# EAGLE board das48 (EAGLE 9.6.2), part 1 of 3
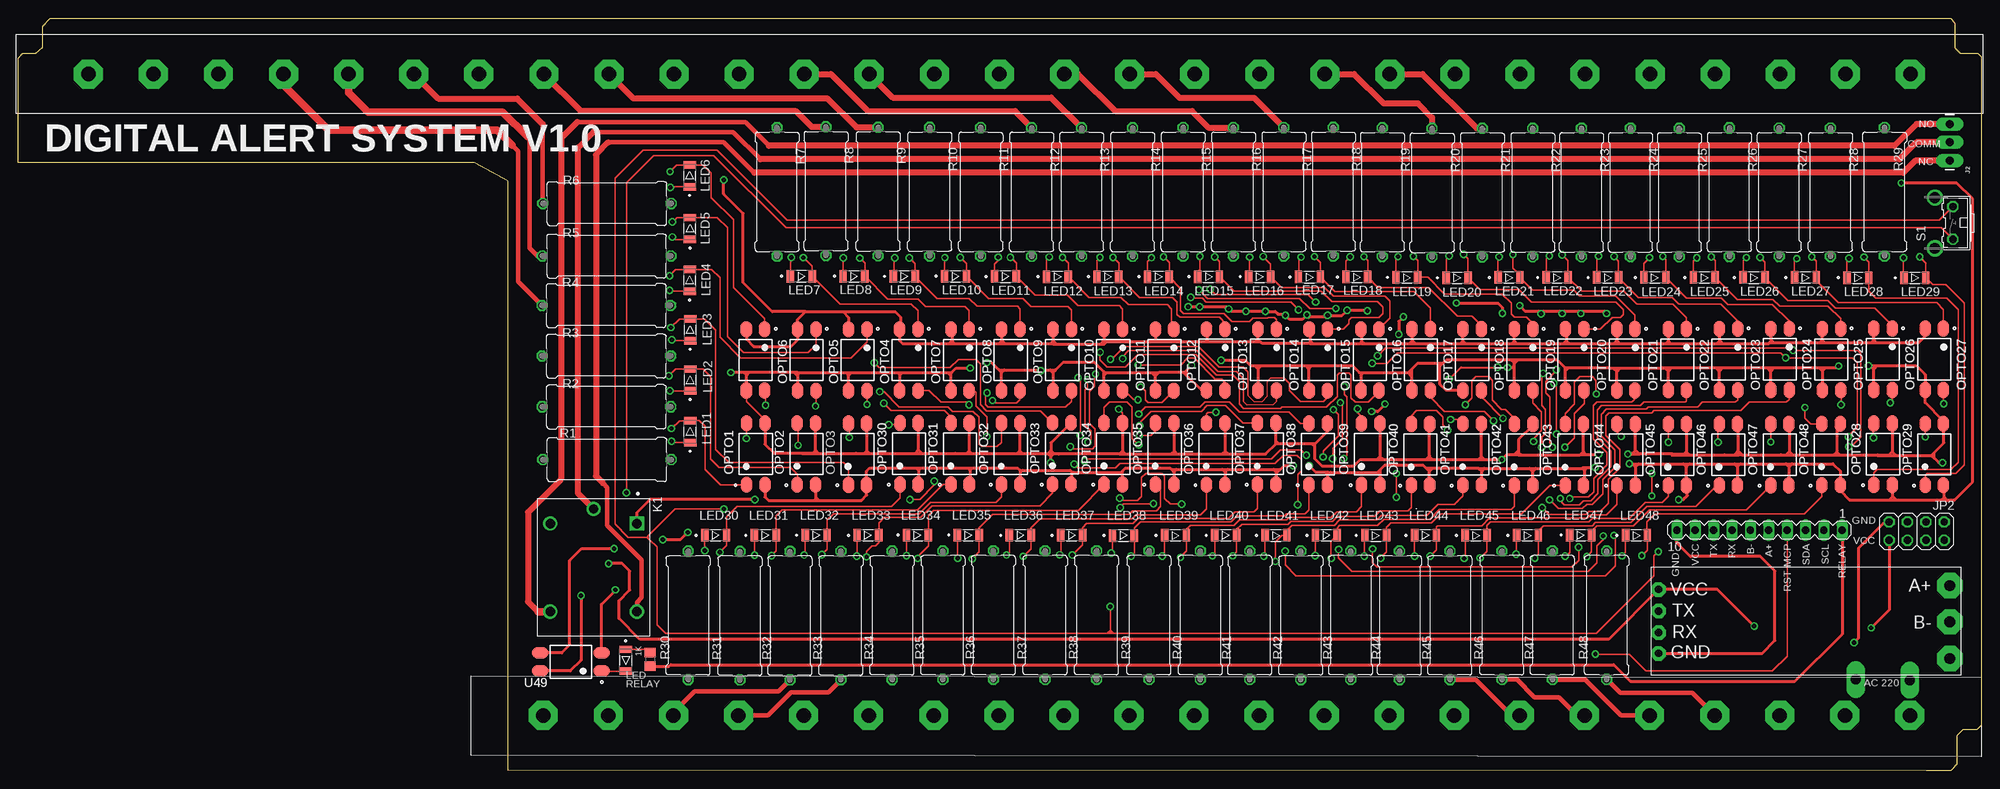
[diagram p1: board, top side]
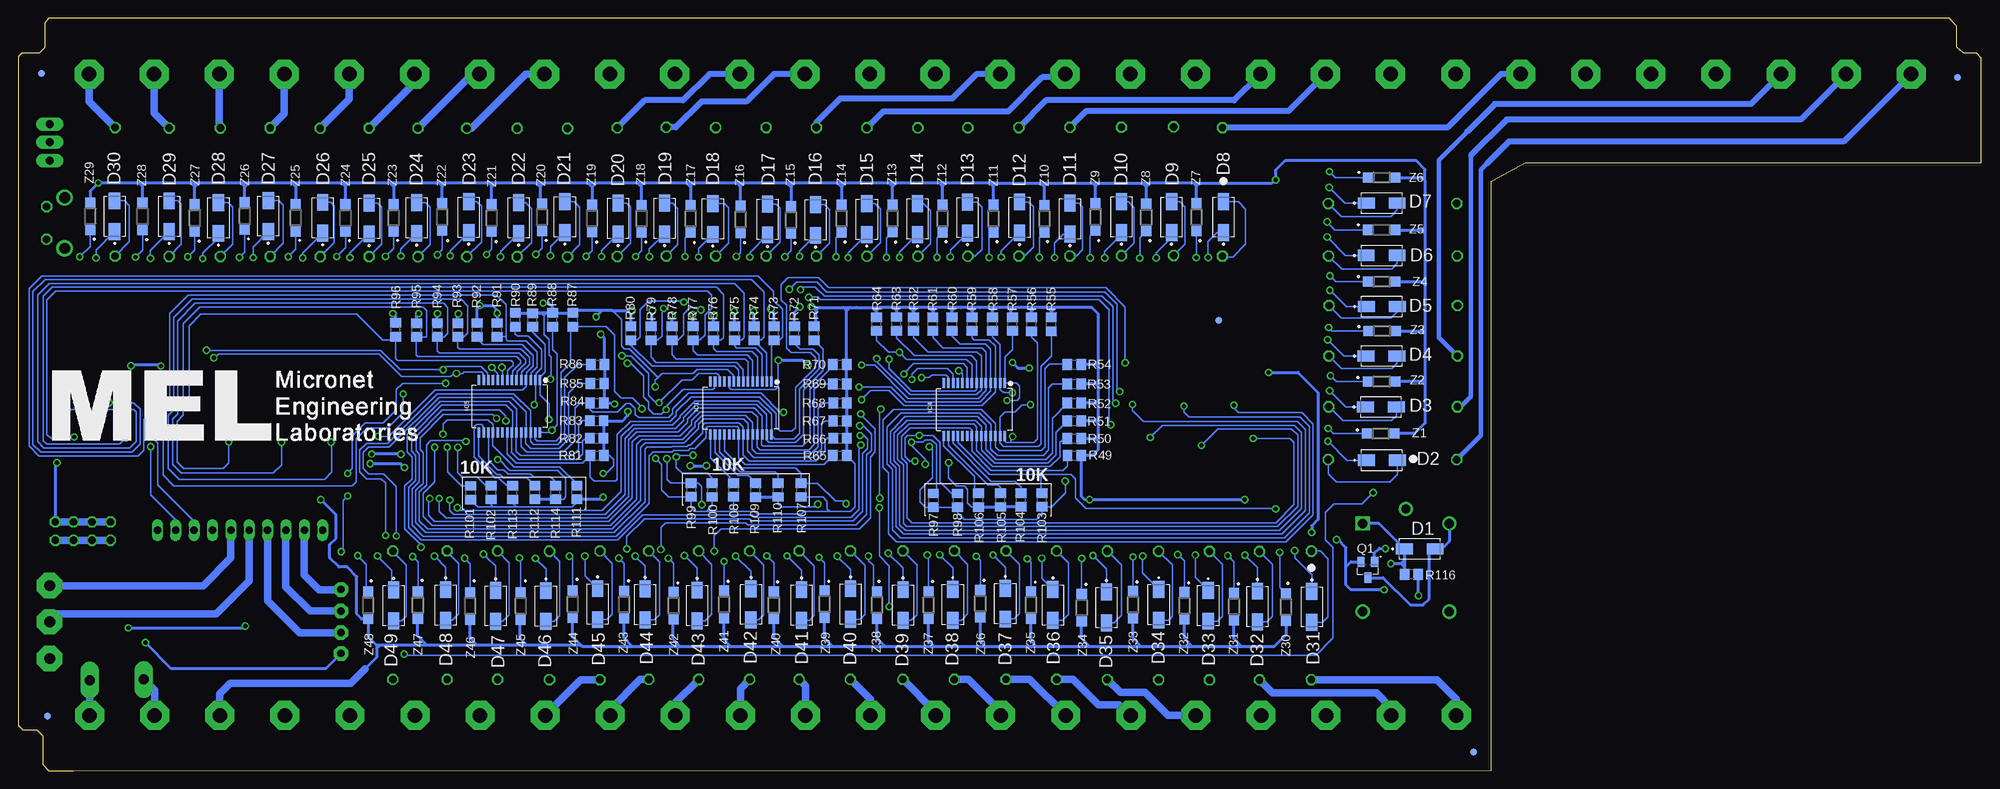
[diagram p2: board, bottom side, seen from below]

Size 271.53 x 104.12 mm. Coordinates in mm from the lower left corner, seen from the top.
Outline: 0.01,84.1 0,97.18 0.01,98.6 0.67,99.26 2.42,99.26 3.4,100.11 3.41,102.98 4.42,104.12 6.94,104.12 264.15,104.12 267.26,104.12 267.87,103.39 267.87,100.03 268.62,99.28 271.02,99.28 271.53,98.77 271.53,96.75 271.53,6.29 270.9,5.67 268.97,5.67 268.14,4.82 268.14,0.86 267.28,0 263.89,0 263.89,0 67.77,0.07 67.8,81.59 63.11,84.1 0.01,84.1
Copper layers (1*16): Top 0.035mm / dielectric 1.5mm / Bottom 0.035mm
Design rules "default *": minimum track width 6mil, minimum drill 0.35mm, track to track 0.2mm, track to pad 0.2mm, pad to pad 0.2mm, via to via 0.2mm, smd to smd 6mil, copper to edge 40mil, drill to drill 0.3mm, minimum pad ring 10mil, minimum via ring 8mil, stop-mask expansion 4mil, vias tented up to drill 25mil, thermal gap 10mil
Net classes: 0 default: drill 0.6 mm, clearance 0.3 mm

## Footprints (pad centres in the part's own frame; a part is rotated, then mirrored left to right if it is on the bottom)
DIOM5226X240N = smd 2.33 x 1.55: A 2.135,0; C -2.135,0
LEDC3216X120N = smd 1.01 x 1.73: + -1.51,0; - 1.51,0
HEADER-29P = drill 2 pad 4 octagon: 1 -109,16.5; 2 -100,16.5; 3 -91,16.5; 4 -82,16.5; 5 -73,16.5; 6 -64,16.5; 7 -55,16.5; 8 -46,16.5; 9 -37,16.5; 10 -28,16.5; 11 -19,16.5; 12 -10,16.5; 13 -1,16.5; 14 8,16.5; 15 17,16.5; 16 26,16.5; 17 35,16.5; 18 44,16.5; 19 53,16.5; 20 62,16.5; 21 71,16.5; 22 80,16.5
HEADER-29P' = drill 2 pad 4 octagon: 1 -116.62,5.07; 2 -107.62,5.07; 3 -98.62,5.07; 4 -89.62,5.07; 5 -80.62,5.07; 6 -71.62,5.07; 7 -62.62,5.07; 8 -53.62,5.07; 9 -44.62,5.07; 10 -35.62,5.07; 11 -26.62,5.07; 12 -17.62,5.07; 13 -8.62,5.07; 14 0.38,5.07; 15 9.38,5.07; 16 18.38,5.07; 17 27.38,5.07; 18 36.38,5.07; 19 45.38,5.07; 20 54.38,5.07; 21 63.38,5.07; 22 72.38,5.07; 23 81.38,5.07; 24 90.38,5.07; 25 99.38,5.07; 26 108.38,5.07; 27 117.38,5.07; 28 126.38,5.07; 29 135.38,5.07
SSOP28DB = smd 0.348 x 1.397: 1 -4.225,-3.656; 2 -3.575,-3.656; 3 -2.925,-3.656; 4 -2.275,-3.656; 5 -1.625,-3.656; 6 -0.975,-3.656; 7 -0.325,-3.656; 8 0.325,-3.656; 9 0.975,-3.656; 10 1.625,-3.656; 11 2.275,-3.656; 12 2.925,-3.656; 13 3.575,-3.656; 14 4.225,-3.656; 15 4.225,3.656; 16 3.575,3.656; 17 2.925,3.656; 18 2.275,3.656; 19 1.625,3.656; 20 0.975,3.656; 21 0.325,3.656; 22 -0.325,3.656; 23 -0.975,3.656; 24 -1.625,3.656; 25 -2.275,3.656; 26 -2.925,3.656; 27 -3.575,3.656; 28 -4.225,3.656
1X03_LONGPADS = drill 1.118 pad 1.88 long: 1 0,0; 2 2.54,0; 3 5.08,0
1X1-BIGPOGO = drill 1.4 pad 2.54 long: P$1 0,0
2X04 = drill 1.016 octagon: 1 -3.81,-1.27; 2 -3.81,1.27; 3 -1.27,-1.27; 4 -1.27,1.27; 5 1.27,-1.27; 6 1.27,1.27; 7 3.81,-1.27; 8 3.81,1.27
RELAY_SRD-05VDC-SL-C = drill 1.32 square: A1 -6.1,6 | drill 1.32: A2 -6.1,-6; NC 6.1,6; NO 6.1,-6 | drill 1.29: COM -8.1,0
SOT254P975X400-4N = smd 2.25 x 1.6: 1 -4.25,1.27; 2 -4.25,-1.27; 3 4.25,-1.27; 4 4.25,1.27
SOT95P240X120-3N = smd 1 x 1.4: 1 -0.95,-1.1; 2 0.95,-1.1; 3 0,1.1
0617/17 = drill 1.016 octagon: 1 -8.89,0; 2 8.89,0
R0805 = smd 1.3 x 1.5: 1 -0.95,0; 2 0.95,0
B3F-31XX = drill 1.016 octagon: 1 -2.261,-1.245; 2 2.261,-1.245 | drill 1.499 pad 2.159: 3 -3.505,1.245; 4 3.505,1.245
MA10-1 = drill 1.016 long: 1 -11.43,0; 2 -8.89,0; 3 -6.35,0; 4 -3.81,0; 5 -1.27,0; 6 1.27,0; 7 3.81,0; 8 6.35,0; 9 8.89,0; 10 11.43,0
TTL-RS485 = drill 1.5 pad 3.5 octagon: A -19.7,-6; B -19.7,-1; P$7 -19.7,4.1 | drill 1 pad 2 octagon: GND 20.6,3.37; RX 20.581,0.505; TX 20.583,-2.493; VCC 20.6,-5.47
FIDUCIAL_1MM = smd 1 x 1: 1 0,0
SOD123 = smd 1.4 x 1.4: A 1.9,0; C -1.9,0

## Placement (x,y rotation side)
D1  US1M-13  [DIOM5226X240N]  77.68,30.68 0 bottom
D2  US1M-13  [DIOM5226X240N]  82.93,42.95 0 bottom
D3  US1M-13  [DIOM5226X240N]  83.06,50.31 0 bottom
D4  US1M-13  [DIOM5226X240N]  82.97,57.38 0 bottom
D5  US1M-13  [DIOM5226X240N]  82.93,64.19 0 bottom
D6  US1M-13  [DIOM5226X240N]  82.95,71.28 0 bottom
D7  US1M-13  [DIOM5226X240N]  82.95,78.53 0 bottom
D8  US1M-13  [DIOM5226X240N]  104.81,76.59 90 bottom
D9  US1M-13  [DIOM5226X240N]  111.99,76.58 90 bottom
D10  US1M-13  [DIOM5226X240N]  118.94,76.59 90 bottom
D11  US1M-13  [DIOM5226X240N]  126.06,76.37 90 bottom
D12  US1M-13  [DIOM5226X240N]  133.02,76.55 90 bottom
D13  US1M-13  [DIOM5226X240N]  140.22,76.51 90 bottom
D14  US1M-13  [DIOM5226X240N]  147.16,76.32 90 bottom
D15  US1M-13  [DIOM5226X240N]  154.16,76.3 90 bottom
D16  US1M-13  [DIOM5226X240N]  161.23,76.2 90 bottom
D17  US1M-13  [DIOM5226X240N]  167.87,76.27 90 bottom
D18  US1M-13  [DIOM5226X240N]  175.46,76.34 90 bottom
D19  US1M-13  [DIOM5226X240N]  182.1,76.39 90 bottom
D20  US1M-13  [DIOM5226X240N]  188.54,76.39 90 bottom
D21  US1M-13  [DIOM5226X240N]  195.91,76.59 90 bottom
D22  US1M-13  [DIOM5226X240N]  202.3,76.48 90 bottom
D23  US1M-13  [DIOM5226X240N]  209.2,76.58 90 bottom
D24  US1M-13  [DIOM5226X240N]  216.41,76.47 90 bottom
D25  US1M-13  [DIOM5226X240N]  222.99,76.39 90 bottom
D26  US1M-13  [DIOM5226X240N]  229.41,76.5 90 bottom
D27  US1M-13  [DIOM5226X240N]  236.92,76.72 90 bottom
D28  US1M-13  [DIOM5226X240N]  243.82,76.46 90 bottom
D29  US1M-13  [DIOM5226X240N]  250.61,76.7 90 bottom
D30  US1M-13  [DIOM5226X240N]  258.19,76.7 90 bottom
D31  US1M-13  [DIOM5226X240N]  92.61,22.66 270 bottom
D32  US1M-13  [DIOM5226X240N]  100.14,22.7 270 bottom
D33  US1M-13  [DIOM5226X240N]  106.94,22.82 270 bottom
D34  US1M-13  [DIOM5226X240N]  113.78,22.96 270 bottom
D35  US1M-13  [DIOM5226X240N]  121.01,22.58 270 bottom
D36  US1M-13  [DIOM5226X240N]  128.43,22.93 270 bottom
D37  US1M-13  [DIOM5226X240N]  135,23.1 270 bottom
D38  US1M-13  [DIOM5226X240N]  142.26,22.95 270 bottom
D39  US1M-13  [DIOM5226X240N]  149.13,22.92 270 bottom
D40  US1M-13  [DIOM5226X240N]  156.42,23.05 270 bottom
D41  US1M-13  [DIOM5226X240N]  163.19,22.91 270 bottom
D42  US1M-13  [DIOM5226X240N]  170.18,23.01 270 bottom
D43  US1M-13  [DIOM5226X240N]  177.62,22.85 270 bottom
D44  US1M-13  [DIOM5226X240N]  184.82,22.99 270 bottom
D45  US1M-13  [DIOM5226X240N]  191.37,23.04 270 bottom
D46  US1M-13  [DIOM5226X240N]  198.54,22.77 270 bottom
D47  US1M-13  [DIOM5226X240N]  205.5,22.8 270 bottom
D48  US1M-13  [DIOM5226X240N]  212.42,22.92 270 bottom
D49  US1M-13  [DIOM5226X240N]  219.61,22.86 270 bottom
D146  LHN974_RED_LED_1206  [LEDC3216X120N]  84.02,15.28 270 top
HEADER-22P1  [HEADER-29P]  181.64,-8.86 0 top
HEADER-29P1  [HEADER-29P']  126.33,91.31 0 top
IC1  MCP23017SS  [SSOP28DB]  171.56,50.18 180 bottom
IC4  MCP23017SS  [SSOP28DB]  139.3,49.98 180 bottom
IC5  MCP23017SS  [SSOP28DB]  203.56,50.42 180 bottom
J2  [1X03_LONGPADS]  267.16,84.39 90 top
JP1  [1X1-BIGPOGO]  261.62,12.52 90 top
JP2  [2X04]  262.58,33.15 0 top
JP3  [1X1-BIGPOGO]  254.15,12.62 90 top
K1  SRD-05VDC-SL-C  [RELAY_SRD-05VDC-SL-C]  79.59,28.1 270 top
LED1  LHN974_RED_LED_1206  [LEDC3216X120N]  92.94,46.89 90 top
LED2  LHN974_RED_LED_1206  [LEDC3216X120N]  92.95,54.06 90 top
LED3  LHN974_RED_LED_1206  [LEDC3216X120N]  92.95,61 90 top
LED4  LHN974_RED_LED_1206  [LEDC3216X120N]  92.89,67.83 90 top
LED5  LHN974_RED_LED_1206  [LEDC3216X120N]  92.92,75.01 90 top
LED6  LHN974_RED_LED_1206  [LEDC3216X120N]  92.88,82.29 90 top
LED7  LHN974_RED_LED_1206  [LEDC3216X120N]  108.31,68.42 0 top
LED8  LHN974_RED_LED_1206  [LEDC3216X120N]  115.61,68.41 0 top
LED9  LHN974_RED_LED_1206  [LEDC3216X120N]  122.56,68.39 0 top
LED10  LHN974_RED_LED_1206  [LEDC3216X120N]  129.65,68.4 0 top
LED11  LHN974_RED_LED_1206  [LEDC3216X120N]  136.56,68.36 0 top
LED12  LHN974_RED_LED_1206  [LEDC3216X120N]  143.74,68.33 0 top
LED13  LHN974_RED_LED_1206  [LEDC3216X120N]  150.73,68.34 0 top
LED14  LHN974_RED_LED_1206  [LEDC3216X120N]  157.7,68.34 0 top
LED15  LHN974_RED_LED_1206  [LEDC3216X120N]  164.64,68.34 0 top
LED16  LHN974_RED_LED_1206  [LEDC3216X120N]  171.72,68.34 0 top
LED17  LHN974_RED_LED_1206  [LEDC3216X120N]  178.59,68.29 0 top
LED18  LHN974_RED_LED_1206  [LEDC3216X120N]  185.15,68.3 0 top
LED19  LHN974_RED_LED_1206  [LEDC3216X120N]  192.07,68.25 0 top
LED20  LHN974_RED_LED_1206  [LEDC3216X120N]  199.02,68.19 0 top
LED21  LHN974_RED_LED_1206  [LEDC3216X120N]  206.18,68.23 0 top
LED22  LHN974_RED_LED_1206  [LEDC3216X120N]  212.85,68.23 0 top
LED23  LHN974_RED_LED_1206  [LEDC3216X120N]  219.83,68.24 0 top
LED24  LHN974_RED_LED_1206  [LEDC3216X120N]  226.37,68.25 0 top
LED25  LHN974_RED_LED_1206  [LEDC3216X120N]  233.19,68.24 0 top
LED26  LHN974_RED_LED_1206  [LEDC3216X120N]  240.08,68.22 0 top
LED27  LHN974_RED_LED_1206  [LEDC3216X120N]  247.18,68.24 0 top
LED28  LHN974_RED_LED_1206  [LEDC3216X120N]  254.45,68.21 0 top
LED29  LHN974_RED_LED_1206  [LEDC3216X120N]  262.33,68.18 0 top
LED30  LHN974_RED_LED_1206  [LEDC3216X120N]  96.48,32.57 0 top
LED31  LHN974_RED_LED_1206  [LEDC3216X120N]  103.35,32.57 0 top
LED32  LHN974_RED_LED_1206  [LEDC3216X120N]  110.38,32.58 0 top
LED33  LHN974_RED_LED_1206  [LEDC3216X120N]  117.54,32.57 0 top
LED34  LHN974_RED_LED_1206  [LEDC3216X120N]  124.38,32.59 0 top
LED35  LHN974_RED_LED_1206  [LEDC3216X120N]  131.41,32.6 0 top
LED36  LHN974_RED_LED_1206  [LEDC3216X120N]  138.61,32.57 0 top
LED37  LHN974_RED_LED_1206  [LEDC3216X120N]  145.71,32.57 0 top
LED38  LHN974_RED_LED_1206  [LEDC3216X120N]  152.86,32.55 0 top
LED39  LHN974_RED_LED_1206  [LEDC3216X120N]  160.07,32.56 0 top
LED40  LHN974_RED_LED_1206  [LEDC3216X120N]  167.02,32.56 0 top
LED41  LHN974_RED_LED_1206  [LEDC3216X120N]  173.98,32.55 0 top
LED42  LHN974_RED_LED_1206  [LEDC3216X120N]  180.93,32.56 0 top
LED43  LHN974_RED_LED_1206  [LEDC3216X120N]  187.76,32.55 0 top
LED44  LHN974_RED_LED_1206  [LEDC3216X120N]  194.64,32.56 0 top
LED45  LHN974_RED_LED_1206  [LEDC3216X120N]  201.64,32.56 0 top
LED46  LHN974_RED_LED_1206  [LEDC3216X120N]  208.75,32.56 0 top
LED47  LHN974_RED_LED_1206  [LEDC3216X120N]  216.1,32.59 0 top
LED48  LHN974_RED_LED_1206  [LEDC3216X120N]  223.81,32.56 0 top
OPTO1  PC817X2NIP0F  [SOT254P975X400-4N]  102.03,43.8 90 top
OPTO2  PC817X2NIP0F  [SOT254P975X400-4N]  109.03,43.81 90 top
OPTO3  PC817X2NIP0F  [SOT254P975X400-4N]  116.09,43.78 90 top
OPTO4  PC817X2NIP0F  [SOT254P975X400-4N]  116.11,56.81 270 top
OPTO5  PC817X2NIP0F  [SOT254P975X400-4N]  109.06,56.81 270 top
OPTO6  PC817X2NIP0F  [SOT254P975X400-4N]  101.99,56.83 270 top
OPTO7  PC817X2NIP0F  [SOT254P975X400-4N]  123.18,56.82 270 top
OPTO8  PC817X2NIP0F  [SOT254P975X400-4N]  130.27,56.82 270 top
OPTO9  PC817X2NIP0F  [SOT254P975X400-4N]  137.31,56.82 270 top
OPTO10  PC817X2NIP0F  [SOT254P975X400-4N]  144.39,56.82 270 top
OPTO11  PC817X2NIP0F  [SOT254P975X400-4N]  151.47,56.82 270 top
OPTO12  PC817X2NIP0F  [SOT254P975X400-4N]  158.55,56.82 270 top
OPTO13  PC817X2NIP0F  [SOT254P975X400-4N]  165.63,56.83 270 top
OPTO14  PC817X2NIP0F  [SOT254P975X400-4N]  172.74,56.83 270 top
OPTO15  PC817X2NIP0F  [SOT254P975X400-4N]  179.83,56.83 270 top
OPTO16  PC817X2NIP0F  [SOT254P975X400-4N]  186.95,56.83 270 top
OPTO17  PC817X2NIP0F  [SOT254P975X400-4N]  194.03,56.84 270 top
OPTO18  PC817X2NIP0F  [SOT254P975X400-4N]  201.11,56.85 270 top
OPTO19  PC817X2NIP0F  [SOT254P975X400-4N]  208.19,56.85 270 top
OPTO20  PC817X2NIP0F  [SOT254P975X400-4N]  215.28,56.84 270 top
OPTO21  PC817X2NIP0F  [SOT254P975X400-4N]  222.36,56.84 270 top
OPTO22  PC817X2NIP0F  [SOT254P975X400-4N]  229.47,56.86 270 top
OPTO23  PC817X2NIP0F  [SOT254P975X400-4N]  236.55,56.88 270 top
OPTO24  PC817X2NIP0F  [SOT254P975X400-4N]  243.66,56.9 270 top
OPTO25  PC817X2NIP0F  [SOT254P975X400-4N]  250.78,56.9 270 top
OPTO26  PC817X2NIP0F  [SOT254P975X400-4N]  257.9,56.93 270 top
OPTO27  PC817X2NIP0F  [SOT254P975X400-4N]  265.02,56.91 270 top
OPTO28  PC817X2NIP0F  [SOT254P975X400-4N]  257.94,43.78 90 top
OPTO29  PC817X2NIP0F  [SOT254P975X400-4N]  265.02,43.75 90 top
OPTO30  PC817X2NIP0F  [SOT254P975X400-4N]  123.22,43.86 90 top
OPTO31  PC817X2NIP0F  [SOT254P975X400-4N]  130.28,43.85 90 top
OPTO32  PC817X2NIP0F  [SOT254P975X400-4N]  137.29,43.84 90 top
OPTO33  PC817X2NIP0F  [SOT254P975X400-4N]  144.36,43.88 90 top
OPTO34  PC817X2NIP0F  [SOT254P975X400-4N]  151.48,43.86 90 top
OPTO35  PC817X2NIP0F  [SOT254P975X400-4N]  158.58,43.85 90 top
OPTO36  PC817X2NIP0F  [SOT254P975X400-4N]  165.63,43.82 90 top
OPTO37  PC817X2NIP0F  [SOT254P975X400-4N]  172.68,43.84 90 top
OPTO38  PC817X2NIP0F  [SOT254P975X400-4N]  179.78,43.78 90 top
OPTO39  PC817X2NIP0F  [SOT254P975X400-4N]  187.09,43.78 90 top
OPTO40  PC817X2NIP0F  [SOT254P975X400-4N]  193.95,43.73 90 top
OPTO41  PC817X2NIP0F  [SOT254P975X400-4N]  201.09,43.75 90 top
OPTO42  PC817X2NIP0F  [SOT254P975X400-4N]  208.2,43.72 90 top
OPTO43  PC817X2NIP0F  [SOT254P975X400-4N]  215.24,43.71 90 top
OPTO44  PC817X2NIP0F  [SOT254P975X400-4N]  222.4,43.72 90 top
OPTO45  PC817X2NIP0F  [SOT254P975X400-4N]  229.47,43.71 90 top
OPTO46  PC817X2NIP0F  [SOT254P975X400-4N]  236.52,43.72 90 top
OPTO47  PC817X2NIP0F  [SOT254P975X400-4N]  243.65,43.71 90 top
OPTO48  PC817X2NIP0F  [SOT254P975X400-4N]  250.72,43.74 90 top
Q1  S9013  [SOT95P240X120-3N]  84.87,27.8 180 bottom
R1  [0617/17]  81.45,43.04 0 top
R2  [0617/17]  81.37,50.35 0 top
R3  [0617/17]  81.36,57.37 0 top
R4  [0617/17]  81.34,64.35 0 top
R5  [0617/17]  81.39,71.21 0 top
R6  [0617/17]  81.45,78.48 0 top
R7  [0617/17]  104.97,80.08 270 top
R8  [0617/17]  111.72,80.18 270 top
R9  [0617/17]  118.94,80.13 270 top
R10  [0617/17]  126.07,80.11 270 top
R11  [0617/17]  133.13,80.08 270 top
R12  [0617/17]  140.18,80.06 270 top
R13  [0617/17]  147.08,80.05 270 top
R14  [0617/17]  154.14,80.06 270 top
R15  [0617/17]  161.12,80.08 270 top
R16  [0617/17]  168.08,80.1 270 top
R17  [0617/17]  175.05,80.09 270 top
R18  [0617/17]  181.89,80.11 270 top
R19  [0617/17]  188.66,80.05 270 top
R20  [0617/17]  195.56,79.97 270 top
R21  [0617/17]  202.51,79.98 270 top
R22  [0617/17]  209.47,79.98 270 top
R23  [0617/17]  216.23,80 270 top
R24  [0617/17]  222.98,80.01 270 top
R25  [0617/17]  229.74,79.98 270 top
R26  [0617/17]  236.67,80.04 270 top
R27  [0617/17]  243.55,80.03 270 top
R28  [0617/17]  250.66,80.03 270 top
R29  [0617/17]  258.13,80.09 270 top
R30  [0617/17]  92.67,21.48 90 top
R31  [0617/17]  99.84,21.43 90 top
R32  [0617/17]  106.76,21.44 90 top
R33  [0617/17]  113.8,21.46 90 top
R34  [0617/17]  120.88,21.48 90 top
R35  [0617/17]  127.91,21.5 90 top
R36  [0617/17]  134.89,21.52 90 top
R37  [0617/17]  142.05,21.51 90 top
R38  [0617/17]  149.17,21.52 90 top
R39  [0617/17]  156.41,21.52 90 top
R40  [0617/17]  163.51,21.51 90 top
R41  [0617/17]  170.34,21.49 90 top
R42  [0617/17]  177.4,21.49 90 top
R43  [0617/17]  184.31,21.49 90 top
R44  [0617/17]  191.06,21.49 90 top
R45  [0617/17]  198.03,21.48 90 top
R46  [0617/17]  205.22,21.5 90 top
R47  [0617/17]  212.2,21.51 90 top
R48  [0617/17]  219.7,21.5 90 top
R49  [R0805]  125.45,43.62 0 bottom
R50  [R0805]  125.46,45.96 0 bottom
R51  [R0805]  125.46,48.37 0 bottom
R52  [R0805]  125.46,50.84 0 bottom
R53  [R0805]  125.46,53.49 0 bottom
R54  [R0805]  125.47,56.19 0 bottom
R55  [R0805]  128.64,61.75 90 bottom
R56  [R0805]  131.37,61.77 90 bottom
R57  [R0805]  134.01,61.8 90 bottom
R58  [R0805]  136.76,61.8 90 bottom
R59  [R0805]  139.61,61.8 90 bottom
R60  [R0805]  142.35,61.8 90 bottom
R61  [R0805]  145.02,61.79 90 bottom
R62  [R0805]  147.71,61.8 90 bottom
R63  [R0805]  150.05,61.8 90 bottom
R64  [R0805]  152.79,61.78 90 bottom
R65  [R0805]  157.88,43.61 0 bottom
R66  [R0805]  157.86,46 0 bottom
R67  [R0805]  157.87,48.4 0 bottom
R68  [R0805]  157.86,50.87 0 bottom
R69  [R0805]  157.88,53.51 0 bottom
R70  [R0805]  157.89,56.17 0 bottom
R71  [R0805]  161.45,60.52 90 bottom
R72  [R0805]  164.13,60.51 90 bottom
R73  [R0805]  166.99,60.52 90 bottom
R74  [R0805]  169.73,60.52 90 bottom
R75  [R0805]  172.43,60.51 90 bottom
R76  [R0805]  175.36,60.51 90 bottom
R77  [R0805]  178.18,60.5 90 bottom
R78  [R0805]  181.1,60.51 90 bottom
R79  [R0805]  184,60.51 90 bottom
R80  [R0805]  186.79,60.51 90 bottom
R81  [R0805]  191.46,43.6 0 bottom
R82  [R0805]  191.51,45.99 0 bottom
R83  [R0805]  191.51,48.4 0 bottom
R84  [R0805]  191.48,50.85 0 bottom
R85  [R0805]  191.43,53.54 0 bottom
R86  [R0805]  191.39,56.2 0 bottom
R87  [R0805]  194.8,62.38 90 bottom
R88  [R0805]  197.61,62.38 90 bottom
R89  [R0805]  200.37,62.35 90 bottom
R90  [R0805]  202.76,62.37 90 bottom
R91  [R0805]  205.3,60.98 90 bottom
R92  [R0805]  208.05,60.98 90 bottom
R93  [R0805]  210.71,60.97 90 bottom
R94  [R0805]  213.54,60.95 90 bottom
R95  [R0805]  216.42,60.96 90 bottom
R96  [R0805]  219.3,60.99 90 bottom
R97  [R0805]  144.97,37.4 270 bottom
R98  [R0805]  141.59,37.4 270 bottom
R99  [R0805]  178.46,38.83 270 bottom
R100  [R0805]  175.54,38.82 270 bottom
R101  [R0805]  208.97,38.44 270 bottom
R102  [R0805]  206.12,38.47 270 bottom
R103  [R0805]  129.91,37.46 90 bottom
R104  [R0805]  132.81,37.45 90 bottom
R105  [R0805]  135.66,37.44 90 bottom
R106  [R0805]  138.7,37.43 90 bottom
R107  [R0805]  163.26,38.82 270 bottom
R108  [R0805]  172.56,38.83 90 bottom
R109  [R0805]  169.53,38.8 90 bottom
R110  [R0805]  166.43,38.82 90 bottom
R111  [R0805]  194.24,38.49 90 bottom
R112  [R0805]  200.07,38.5 90 bottom
R113  [R0805]  203.12,38.48 90 bottom
R114  [R0805]  197.19,38.5 90 bottom
R115  1K  [R0805]  87.4,15.4 270 top
R116  [R0805]  78.84,27.14 180 bottom
S1  [B3F-31XX]  266.35,75.78 90 top
SV1  [MA10-1]  240.84,33.29 180 top
TTL-RS1  [TTL-RS485]  247.47,19.6 180 top
U49  PC817X2NIP0F  [SOT254P975X400-4N]  76.44,15.06 180 top
U$1  FIDUCIAL  [FIDUCIAL_1MM]  3.3,95.88 0 bottom
U$2  FIDUCIAL  [FIDUCIAL_1MM]  268.28,96.49 0 bottom
U$3  FIDUCIAL  [FIDUCIAL_1MM]  105.51,62.33 0 bottom
U$4  FIDUCIAL  [FIDUCIAL_1MM]  267.46,7.54 0 bottom
U$5  FIDUCIAL  [FIDUCIAL_1MM]  70.21,2.61 0 bottom
Z1  [SOD123]  83.08,46.63 0 bottom
Z2  [SOD123]  82.96,53.83 0 bottom
Z3  [SOD123]  82.89,60.85 0 bottom
Z4  [SOD123]  82.95,67.66 0 bottom
Z5  [SOD123]  82.97,74.82 0 bottom
Z6  [SOD123]  82.95,82.06 0 bottom
Z7  [SOD123]  108.54,76.58 90 bottom
Z8  [SOD123]  115.51,76.55 90 bottom
Z9  [SOD123]  122.52,76.6 90 bottom
Z10  [SOD123]  129.6,76.37 90 bottom
Z11  [SOD123]  136.65,76.38 90 bottom
Z12  [SOD123]  143.66,76.38 90 bottom
Z13  [SOD123]  150.62,76.38 90 bottom
Z14  [SOD123]  157.67,76.37 90 bottom
Z15  [SOD123]  164.62,76.18 90 bottom
Z16  [SOD123]  171.62,76.26 90 bottom
Z17  [SOD123]  178.5,76.36 90 bottom
Z18  [SOD123]  185.32,76.36 90 bottom
Z19  [SOD123]  192.15,76.39 90 bottom
Z20  [SOD123]  199.07,76.57 90 bottom
Z21  [SOD123]  206.02,76.47 90 bottom
Z22  [SOD123]  212.87,76.59 90 bottom
Z23  [SOD123]  219.61,76.48 90 bottom
Z24  [SOD123]  226.26,76.46 90 bottom
Z25  [SOD123]  233.13,76.51 90 bottom
Z26  [SOD123]  240.18,76.74 90 bottom
Z27  [SOD123]  247.11,76.46 90 bottom
Z28  [SOD123]  254.32,76.71 90 bottom
Z29  [SOD123]  261.58,76.71 90 bottom
Z30  [SOD123]  96.21,22.65 270 bottom
Z31  [SOD123]  103.35,22.7 270 bottom
Z32  [SOD123]  110.24,22.82 270 bottom
Z33  [SOD123]  117.33,22.99 270 bottom
Z34  [SOD123]  124.43,22.56 270 bottom
Z35  [SOD123]  131.46,22.92 270 bottom
Z36  [SOD123]  138.46,23.11 270 bottom
Z37  [SOD123]  145.6,22.92 270 bottom
Z38  [SOD123]  152.76,22.93 270 bottom
Z39  [SOD123]  159.98,23.06 270 bottom
Z40  [SOD123]  167.01,22.9 270 bottom
Z41  [SOD123]  173.88,23 270 bottom
Z42  [SOD123]  180.87,22.84 270 bottom
Z43  [SOD123]  187.7,22.98 270 bottom
Z44  [SOD123]  194.82,23.03 270 bottom
Z45  [SOD123]  202.01,22.78 270 bottom
Z46  [SOD123]  209.01,22.79 270 bottom
Z47  [SOD123]  216.23,22.91 270 bottom
Z48  [SOD123]  223.13,22.88 270 bottom

## Tracks (layer width: path | path; a pad name or v marks a point on that pad's centre or on a via)
A+
  Bottom 1.016: TTL-RS1.A 245.93,25.6 242.11,29.41 SV1.5
B-
  Bottom 1.016: TTL-RS1.B 266.1,21.66 244.14,21.66 239.57,26.23 SV1.6
COMM  (via drill 0.6)
  Top 0.406: OPTO6.2 100.72,59.71 101.73,58.69 106.91,58.69 107.88,59.66 107.88,60.97 OPTO5.2 107.79,62.39 108.89,63.49 | 108.89,63.49 114.07,63.49 | 114.07,63.49 114.89,62.68 114.89,61.1 OPTO4.2 | 114.07,63.49 121.29,63.49 122.05,62.73 122.05,61.2 OPTO7.2 121.91,59.49 122.33,59.07 128.73,59.07 | 128.73,59.07 129.01,59.07 | 129.01,59.07 129.14,59.2 129.14,59.48 | 129.14,59.48 129.14,60.94 OPTO8.2 | 129.01,59.07 129.54,59.07 | 129.54,59.07 135.64,59.07 | 135.64,59.07 136.04,59.07 | 136.04,59.07 136.07,59.1 136.07,59.51 | 136.07,59.51 136.07,61.03 OPTO9.2 | 136.04,59.07 136.5,59.07 | 136.5,59.07 142.75,59.07 | 142.75,59.07 143.18,59.07 | 143.18,59.07 143.16,59.05 143.59,59.05 | 143.18,59.07 143.18,59.45 | 143.18,59.45 143.18,61.01 OPTO10.2 | 143.59,59.05 149.76,59.05 | 149.76,59.05 150.07,59.05 | 150.29,60.97 OPTO11.2 150.2,59.66 | OPTO12.2 157.36,61 157.36,59.73 | 164.15,59.32 164.39,59.56 | 164.39,59.56 164.39,61.05 OPTO13.2 | 171.83,59.32 171.47,59.32 | 171.47,59.32 171.05,59.32 | 171.05,59.32 164.63,59.32 | 164.63,59.32 164.15,59.32 | 178.67,59.4 178.67,60.97 OPTO15.2 | 178.67,59.4 178.67,59.1 | 185.8,59.35 185.61,59.16 185.68,59.1 179.07,59.1 | 185.8,59.35 185.8,59.12 186.13,59.12 | 185.8,59.45 185.8,60.96 OPTO16.2 | 185.8,59.45 185.8,59.35 | 186.13,59.12 192.43,59.12 | 192.43,59.12 193.25,59.12 | 192.84,59.3 192.84,59.53 | 192.84,59.53 192.84,61 OPTO17.2 | 193.25,59.12 199.51,59.12 | 199.51,59.12 199.77,59.12 | 199.84,59.45 199.84,59.2 199.77,59.12 | 199.84,59.45 OPTO18.2 | 199.77,59.12 200.17,59.12 | 200.17,59.12 206.59,59.12 | 206.59,59.12 206.89,59.12 | 206.92,59.45 206.92,59.16 206.89,59.12 | 206.92,59.45 OPTO19.2 | 206.89,59.12 207.25,59.12
  Top 0.406: 207.25,59.12 213.72,59.12 | 213.72,59.12 214.1,59.51 | 214.1,59.51 214.1,61 OPTO20.2 | 213.72,59.12 214.48,59.12 | 214.48,59.12 220.75,59.12 | 220.75,59.12 221.13,59.12 | 221.13,59.12 221.13,59.51 | 221.13,59.51 221.13,61.04 OPTO21.2 | 221.13,59.12 221.52,59.12 | 221.52,59.12 227.89,59.12 | 227.89,59.12 228.22,59.12 | 228.22,59.12 228.22,59.45 | 228.22,59.45 228.22,61.09 OPTO22.2 | 228.22,59.12 228.55,59.12 | 228.55,59.12 234.95,59.12 | 234.95,59.12 235.71,59.12 | 235.33,59.3 235.33,59.51 | 235.33,59.51 235.33,61.07 OPTO23.2 | 235.71,59.12 242.12,59.12 242.26,59.26 | 242.26,59.26 242.42,59.43 242.42,59.66 | 242.42,59.66 242.42,61.12 OPTO24.2 | 242.26,59.26 242.81,59.26 | 242.81,59.26 249.23,59.26 | 249.23,59.26 249.53,59.26 | 249.53,59.26 249.53,59.51 | 249.53,59.51 249.53,61.12 OPTO25.2 | 249.53,59.26 249.84,59.26 | 249.84,59.26 256.34,59.26 | 256.34,59.26 256.56,59.26 | 256.63,59.56 256.63,59.34 256.56,59.26 | 256.63,59.56 OPTO26.2 | 256.56,59.26 256.92,59.26 | 256.92,59.26 262.88,59.26 263.76,60.14 OPTO27.2 | OPTO1.2 103.3,37.87 103.76,37.41 110.09,37.41 | 110.34,37.66 110.42,37.74 110.75,37.41 | 110.34,37.66 110.34,39.52 OPTO2.2 | 110.09,37.41 110.75,37.41 | 110.75,37.41 116.64,37.41 117.36,38.13 OPTO3.2 117.36,41.46 117.78,41.88 124.21,41.88 | 124.21,41.88 124.54,41.55 | 124.54,41.55 124.54,39.65 OPTO30.2 | 124.21,41.88 124.87,41.88 | 124.87,41.88 131.35,41.88 | 131.35,41.88 131.63,41.6 | 131.63,41.6 131.63,39.67 OPTO31.2 | 131.35,41.88 131.98,41.88 | 131.98,41.88 138.25,41.88 138.57,41.56 | 138.57,41.56 138.58,41.55 138.58,41.21 | 138.58,41.21 138.58,39.62 OPTO32.2 | 138.57,41.56 138.94,41.56 | 138.94,41.56 145.5,41.56 145.7,41.37
  Top 0.406: 145.7,41.37 145.8,41.26 146,41.26 | 145.7,41.37 145.7,40.96 | 145.7,40.96 145.7,39.69 OPTO33.2 | 159.52,41.65 159.55,41.65 159.52,41.67 160.17,41.67 | 159.85,41.33 OPTO35.2 | 159.52,41.65 159.39,41.78 153.07,41.78 152.75,41.46 | 159.52,41.65 159.85,41.33 | 160.17,41.67 166.55,41.67 | 166.55,41.67 166.52,41.7 167.29,41.7 | 166.55,41.67 166.98,41.24 | 166.98,41.24 166.98,39.65 OPTO36.2 | 167.29,41.7 173.64,41.7 | 173.64,41.7 173.99,41.34 173.99,41.09 | 173.99,41.09 173.99,39.63 OPTO37.2 | 181.19,41.27 181.19,40.95 | 181.19,40.91 181.19,39.67 OPTO38.2 | 188.36,41.27 188.05,41.27 | 181.19,41.27 181.51,41.27 | 181.51,41.27 188.01,41.27 | 188.36,41.62 188.36,41.27 | 188.36,41.27 188.36,40.96 | 188.36,40.96 OPTO39.2 | OPTO40.2 195.22,41.38 | 194.77,41.83 194.39,42.21 188.93,42.21 188.36,41.64 188.36,41.62 | 194.77,41.83 195.22,41.38 | 201.98,41.83 195.63,41.83 | 195.63,41.83 194.77,41.83 | 201.98,41.83 202.42,41.4 | 202.42,41.4 202.42,39.56 OPTO41.2 | 201.98,41.83 202.75,41.83 | 202.75,41.83 209.02,41.83 | 209.02,41.83 209.5,41.34 | 209.5,41.34 209.5,39.5 OPTO42.2 | 209.02,41.83 209.91,41.83 | 209.91,41.83 216.31,41.83 | 216.31,41.83 216.36,41.83 216.33,41.85 216.92,41.85 | 216.31,41.83 216.59,41.55 216.59,41.52 | 216.59,41.52 216.59,39.53 OPTO43.2 | 223.67,42.03 223.24,42.46 v222.84,42.46 224.13,42.46 | 223.67,42.03 OPTO44.2 | 224.13,42.46 230.28,42.46 | 230.74,42 OPTO45.2 230.86,39.34 230.86,38.04 230.33,37.51 v229.67,37.51 | 230.28,42.46 230.74,42 | 230.28,42.46 231.14,42.46 | 231.14,42.46 237.37,42.46 | 237.79,42.03 OPTO46.2 | 237.37,42.46 237.79,42.03 | 237.37,42.46 238.2,42.46 | 238.2,42.46 244.5,42.46 | 244.92,42.05 OPTO47.2
  Top 0.406: 244.5,42.46 244.92,42.05 | 244.5,42.46 245.37,42.46 | 245.37,42.46 251.01,42.46 252,41.47 OPTO48.2 251.99,38.76 253.29,37.46 258.8,37.46 | 258.8,37.46 259.26,37.92 | 259.26,37.92 259.26,39.48 OPTO28.2 | 258.8,37.46 259.74,37.46 | 259.74,37.46 266.04,37.46 | 266.37,37.79 266.04,37.46 | 266.37,37.79 266.37,39.42 OPTO29.2 | 108.89,63.49 104.29,63.49 100.28,67.51 100.28,77.08 97.59,79.77 97.59,81.71 v97.61,81.73 | 266.04,37.46 266.7,37.46 | 266.7,37.46 267.82,37.46 270.31,39.95 270.31,79.12 268.15,81.27 260.45,81.27 v260.45,81.3 | 178.67,59.1 179.07,59.1 | v218.09,41.95 217.99,41.85 216.92,41.85 | 181.19,41.27 180.83,41.27 | 180.83,41.27 179.48,41.27 v178.56,42.18 | v176.33,42.18 175.08,42.18 174.59,41.69 | 174.59,41.69 173.99,41.09 | 146,41.26 152.55,41.26 | OPTO34.2 152.75,40.96 | 152.75,40.96 152.75,41.46 | 152.75,41.46 152.55,41.26 | 156.94,59.32 157.36,59.73 | 164.15,59.32 157.67,59.32 | 157.67,59.32 156.94,59.32 | 157.67,59.32 157.36,59.64 157.36,59.73 | 256.92,59.26 256.63,59.56 | 256.63,59.56 | 256.63,59.56 256.34,59.26 | 249.53,59.51 249.6,59.51 249.84,59.26 | 249.53,59.51 249.47,59.51 249.23,59.26 | 242.81,59.26 242.42,59.66 | 235.71,59.12 235.33,59.51 | 234.95,59.12 235.33,59.51 | 228.22,59.45 228.55,59.12 | 228.22,59.45 227.89,59.12 | 221.13,59.51 221.52,59.12 | 221.13,59.51 220.75,59.12 | 214.1,59.51 214.48,59.12 | 206.92,59.45 207.25,59.12 | 206.59,59.12 206.92,59.45 | 199.84,59.45 200.17,59.12 | 199.51,59.12 199.84,59.45 | 193.25,59.12 192.84,59.53 | 192.43,59.12 192.84,59.53 | 186.13,59.12 185.8,59.45 | 178.67,59.4 178.77,59.4 179.07,59.1 | 178.67,59.1 172.05,59.1 171.83,59.32 | 171.47,59.32 171.47,59.67 | 171.47,59.75 OPTO14.2
  Top 0.406: 171.05,59.32 171.47,59.75 | 171.83,59.32 171.47,59.67 | 171.47,59.67 171.47,59.75 | 164.39,59.56 164.63,59.32 | 150.2,59.48 150.2,59.18 150.07,59.05 | 156.94,59.32 150.54,59.32 | 150.54,59.32 150.2,59.66 | 150.07,59.05 150.27,59.05 150.54,59.32 | 150.2,59.66 150.2,59.48 | 150.2,59.48 149.76,59.05 | 143.59,59.05 143.18,59.45 | 142.75,59.07 143.13,59.45 143.18,59.45 | 135.64,59.07 136.07,59.51 | 136.07,59.51 136.5,59.07 | 129.14,59.48 128.73,59.07 | 129.14,59.48 129.54,59.07 | 124.54,41.55 124.87,41.88 | 131.63,41.6 131.7,41.6 131.98,41.88 | 138.58,41.21 138.94,41.56 | 145.7,40.96 146,41.26 | 152.75,40.96 152.55,41.16 152.55,41.26 | 159.85,41.33 160.17,41.65 160.17,41.67 | 166.98,41.24 166.98,41.4 167.29,41.7 | 216.59,41.52 216.92,41.85 | 209.5,41.34 209.5,41.42 209.91,41.83 | 202.42,41.4 202.42,41.5 202.75,41.83 | 195.22,41.38 195.22,41.41 195.63,41.83 | 188.36,40.96 188.05,41.27 | 188.05,41.27 188.01,41.27 | 188.01,41.27 188.36,41.62 | 181.19,40.91 181.19,40.95 | 181.19,40.95 181.51,41.27 | 181.19,40.91 180.83,41.27 | 223.67,42.03 223.7,42.03 224.13,42.46 | 230.74,42 230.74,42.06 231.14,42.46 | 237.79,42.03 238.2,42.44 238.2,42.46 | 244.92,42.05 244.95,42.05 245.37,42.46 | 259.26,37.92 259.29,37.92 259.74,37.46 | 266.7,37.46 266.37,37.79 | 110.09,37.41 110.34,37.66 | 173.64,41.7 174.58,41.7 174.59,41.69
  Bottom 0.406: Z7.A 108.54,80.84 | 108.54,80.84 108.99,81.3 | 108.99,81.3 115.01,81.3 | 115.01,81.3 115.52,80.79 | 115.52,80.79 Z8.A | Z9.A 122.52,80.85 | 122.07,81.3 115.98,81.3 | 115.98,81.3 115.01,81.3 | 122.52,80.85 122.07,81.3 | Z10.A 129.6,80.86 | 129.16,81.3 129.6,80.86 | 129.16,81.3 122.97,81.3 | 122.97,81.3 122.07,81.3 | Z11.A 136.65,80.87 | 136.22,81.3 136.65,80.87 | 136.22,81.3 130.1,81.3 | 130.1,81.3 129.16,81.3 | Z12.A 143.66,80.83 | 143.66,80.83 143.66,80.9 143.26,81.3 | 136.22,81.3 137.11,81.3 | 137.11,81.3 143.26,81.3 | 143.26,81.3 144.12,81.3 | 144.12,81.3 150.14,81.3 | Z13.A 150.62,80.82 | 150.62,80.82 150.14,81.3 | 150.14,81.3 151.09,81.3 | 151.09,81.3 157.2,81.3 | 157.67,80.84 Z14.A | 157.2,81.3 157.67,80.84 | 157.2,81.3 158.19,81.3 | 158.19,81.3 164.29,81.3 | 164.29,81.3 164.65,80.94 164.65,80.79 | 164.65,80.79 164.65,78.1 Z15.A | 164.29,81.3 165.15,81.3 | 165.15,81.3 171.22,81.3 | 171.22,81.3 171.66,80.87 | 171.66,80.87 171.66,78.2 Z16.A | 171.22,81.3 172.11,81.3 | 172.11,81.3 178.16,81.3 | 178.16,81.3 178.51,80.94 178.51,80.74 | 178.51,80.74 178.51,78.27 Z17.A | 178.16,81.3 179.07,81.3 | 179.07,81.3 184.99,81.3 | 184.99,81.3 185.35,80.94 | 185.35,80.94 185.35,78.29 Z18.A | 184.99,81.3 185.88,81.3 | 185.88,81.3 191.59,81.3 | 192.15,80.75 Z19.A | 191.59,81.3 192.15,80.75 | 191.59,81.3 192.69,81.3 | 192.69,81.3 198.83,81.3 | 198.83,81.3 199.34,80.79 | 199.34,80.79 199.34,78.74 Z20.A | 198.83,81.3 199.8,81.3 | 199.8,81.3 205.49,81.3 | Z21.A 206.02,80.77 | 205.49,81.3 206.02,80.77 | 205.49,81.3 206.4,81.3 | 206.4,81.3 212.42,81.3 | Z22.A 212.87,80.85 | 212.42,81.3 212.87,80.85 | 212.42,81.3 213.32,81.3 | 213.32,81.3 219.18,81.3 | 219.61,80.86 Z23.A | 219.18,81.3 219.61,80.86
  Bottom 0.406: 219.18,81.3 220.07,81.3 | 220.07,81.3 225.83,81.3 | Z24.A 226.26,80.88 | 225.83,81.3 226.26,80.88 | 225.83,81.3 226.68,81.3 | 226.68,81.3 232.72,81.3 | 232.72,81.3 233.15,80.87 | 233.15,80.87 233.15,78.42 Z25.A | 232.72,81.3 233.63,81.3 | 233.63,81.3 239.65,81.3 | Z26.A 240.18,80.77 | 239.65,81.3 240.18,80.77 | 239.65,81.3 240.64,81.3 | 240.64,81.3 246.51,81.3 | Z27.A 247.11,80.7 | 246.51,81.3 247.11,80.7 | 246.51,81.3 247.4,81.3 | 247.4,81.3 247.6,81.3 | 247.6,81.3 253.93,81.3 | 253.93,81.3 254.36,80.87 | 254.36,80.87 254.36,78.64 Z28.A | 253.93,81.3 254.71,81.3 | 254.71,81.3 v260.45,81.3 261.58,80.17 Z29.A | Z30.A 96.21,18.8 97.84,17.16 102.26,17.16 | 102.26,17.16 103.38,18.28 103.38,20.78 Z31.A | 102.26,17.16 109.1,17.16 | Z32.A 110.24,18.31 109.1,17.16 | 109.1,17.16 116.16,17.16 | 116.16,17.16 117.38,18.38 117.38,21.05 Z33.A | 116.16,17.16 123.32,17.16 | 123.32,17.16 124.44,18.28 Z34.A | 123.32,17.16 130.69,17.16 | 130.69,17.16 131.47,17.95 131.47,21 Z35.A | 130.69,17.16 137.72,17.16 | Z36.A 138.46,17.9 137.72,17.16 | 137.72,17.16 144.81,17.16 | Z37.A 145.6,17.96 144.81,17.16 | 144.81,17.16 151.59,17.16 | Z38.A 152.76,18.34 151.59,17.16 | 151.59,17.16 158.83,17.16 | Z39.A 159.98,18.32 158.83,17.16 | 158.83,17.16 165.71,17.16 | Z40.A 167.01,18.46 165.71,17.16 | 165.71,17.16 172.9,17.16 | 172.9,17.16 173.92,18.18 173.92,21.07 Z41.A | 172.9,17.16 179.94,17.16 | 179.94,17.16 180.93,18.15 180.93,20.89 Z42.A | 179.94,17.16 186.51,17.16 | Z43.A 187.7,18.35 186.51,17.16 | 186.51,17.16 193.5,17.16 193.69,17.35 | 193.69,17.35 194.85,18.51 194.85,21.11 Z44.A | 193.69,17.35 201.13,17.35 | 201.13,17.35 202.08,18.31 202.08,20.81 Z45.A | 201.13,17.35 208.02,17.35
  Bottom 0.406: Z46.A 209.01,18.35 208.02,17.35 | 208.02,17.35 214.98,17.35 | 214.98,17.35 216.26,18.64 216.26,20.98 Z47.A | 214.98,17.35 221.54,17.35 | 221.54,17.35 221.93,17.35 | 221.93,17.35 223.12,18.54 223.12,20.97 Z48.A 224.01,20.98 224.69,21.66 224.69,26.82 226.04,28.16 227.13,28.16 228.42,29.46 228.42,31.29 227.56,32.15 227.56,35.4 v229.67,37.51 | Z6.A 77.37,82.06 76.94,81.63 | 76.94,81.63 76.94,75.18 | 76.94,75.18 77.35,74.77 | 77.35,74.77 81.02,74.77 Z5.A | 76.94,75.18 76.94,74.39 | 76.94,74.39 76.94,68.01 | 76.94,68.01 77.32,67.63 | 77.32,67.63 81.03,67.63 Z4.A | 76.94,68.01 76.94,67.25 | 76.94,67.25 76.94,61.23 | 76.94,61.23 77.4,60.78 | 77.4,60.78 80.92,60.78 Z3.A | 76.94,61.23 76.94,60.32 | 76.94,60.32 76.94,54.25 | 77.35,53.83 Z2.A | 76.94,54.25 77.35,53.83 | 76.94,54.25 76.94,53.41 | 76.94,53.41 76.94,48.1 78.41,46.63 Z1.A | 76.94,81.63 76.94,83.18 78.13,84.37 96.32,84.37 97.64,83.05 97.64,81.76 | 221.93,17.35 221.93,16.96 | 223.52,14.12 221.93,15.7 221.93,16.94 221.93,16.96 | v178.56,42.18 176.46,42.18 176.41,42.13 176.38,42.13 v176.33,42.18 | 97.64,81.76 v97.61,81.73 | 108.99,81.3 108.08,81.3 | 108.08,81.3 98.1,81.3 97.64,81.76 | v218.09,41.95 218.6,42.46 v222.84,42.46 | 76.94,53.41 77.35,53.82 77.35,53.83 | 77.4,60.78 76.94,60.32 | 77.32,67.63 76.94,67.25 | 77.35,74.77 77.32,74.77 76.94,74.39 | 254.36,80.87 254.71,81.22 254.71,81.3 | 247.11,80.81 247.11,81.01 247.4,81.3 | 247.11,80.7 247.11,80.81 | 247.11,80.81 247.6,81.3 | 240.18,80.77 240.18,80.84 240.64,81.3 | 233.15,80.87 233.2,80.87 233.63,81.3 | 226.26,80.88 226.68,81.3 | 219.61,80.86 219.63,80.86 220.07,81.3 | 212.87,80.85 213.32,81.3 | 206.02,80.77 206.02,80.92 206.4,81.3
  Bottom 0.406: 199.34,80.79 199.8,81.25 199.8,81.3 | 192.15,80.75 192.69,81.29 192.69,81.3 | 185.35,80.94 185.52,80.94 185.88,81.3 | 178.51,80.74 179.07,81.3 | 171.66,80.87 171.68,80.87 172.11,81.3 | 164.65,80.79 165.15,81.3 | 157.67,80.84 157.73,80.84 158.19,81.3 | 150.62,80.82 151.09,81.3 | 143.66,80.83 144.12,81.3 | 136.65,80.87 136.69,80.87 137.11,81.3 | 129.6,80.86 129.66,80.86 130.1,81.3 | 122.52,80.85 122.97,81.3 | 115.52,80.79 115.98,81.25 115.98,81.3 | 108.54,80.84 108.08,81.3 | 221.54,17.35 221.93,16.96
  Bottom 1.016: HEADER-22P1.20 243.64,10.66 242.21,12.09 225.55,12.09 223.52,14.12
COMMON
  Top 0.61: 102.66,84.59 98.89,88.36 79.56,88.36
  Top 0.813: J2.2 262.53,86.93 260.19,84.59 102.66,84.59 | K1.COM 77.42,38.37 77.42,86.23 79.56,88.36
GND  (via drill 0.6)
  Top 0.2: 103.3,48.51 100.72,51.1 OPTO6.3 | v160.91,36.87 159.36,36.87 158.57,37.66 158.57,40.76 158.18,41.15 156,41.15 155.37,40.53 155.37,37.92 154.84,37.38 152.7,37.38 v152.38,37.71 | v152.21,50.02 152.75,49.48 OPTO34.3 | v141.42,55.34 141.42,55.43 | 143.91,43.71 143.91,43.81
  Top 0.406: 101.09,55.06 100.72,54.68 | 107.79,55.06 107.34,55.06 | 107.34,55.06 101.09,55.06 | 107.79,55.06 107.79,54.73 | 107.79,54.73 OPTO5.3 | 107.79,55.06 108.12,55.06 | 108.12,55.06 114.51,55.06 | 114.51,55.06 114.89,55.06 | 114.89,55.06 114.89,54.68 | 114.89,54.68 114.89,52.6 OPTO4.3 | 114.89,55.06 115.27,55.06 | 115.27,55.06 121.64,55.06 | 121.64,55.06 121.95,55.06 | 121.95,55.06 121.97,55.04 121.97,54.73 | 121.97,54.73 121.97,52.63 OPTO7.3 | 121.95,55.06 122.3,55.06 | 122.3,55.06 128.63,55.06 | 128.63,55.06 128.91,55.06 | OPTO8.3 129,54.63 | 129,54.63 129,54.96 | 128.91,55.06 129,54.96 | OPTO9.3 136.04,55.06 | 135.67,55.43 136.4,55.43 | 136.4,55.43 141.42,55.43 142.75,55.43 | 142.75,55.43 143.45,55.43 | OPTO10.3 143.12,55.02 143.08,55.06 | OPTO11.3 150.2,54.68 | 150.57,55.06 156.77,55.06 | 156.77,55.06 157.76,55.06 | 171.47,55.57 OPTO14.3 | 171.02,56.03 171.47,55.57 | 171.02,56.03 170.46,56.03 169.7,56.79 v166.4,56.79 | 171.02,56.03 171.91,56.03 | 171.91,56.03 178.08,56.03 | OPTO15.3 178.56,55.55 | 178.08,56.03 178.56,55.55 | 178.08,56.03 178.97,56.03 | 178.97,56.03 184.53,56.03 185.5,55.06 | 185.68,54.66 185.68,54.88 185.5,55.06 | 185.68,54.66 OPTO16.3 | 185.5,55.06 186.08,55.06 | 186.08,55.06 192.26,55.06 | 192.26,55.06 192.28,55.06 | 220.07,55.7 220.09,55.67 220.65,55.67 221.08,55.24 | OPTO21.3 221.08,55.24 | 220.07,55.7 221.54,55.7 | 221.54,55.7 227.43,55.7 | 227.43,55.7 227.74,55.7 228.2,55.23 | OPTO22.3 228.2,55.23 | 227.43,55.7 227.38,55.75 228.65,55.75 | 228.65,55.75 234.75,55.75 | OPTO23.3 235.28,55.22 | 234.75,55.75 235.28,55.22 | 234.75,55.75 235.71,55.75 | 235.71,55.75 241.89,55.75 | OPTO24.3 242.39,55.24 | 241.89,55.75 242.39,55.24
  Top 0.406: 241.89,55.75 242.83,55.75 | 242.83,55.75 249.07,55.75 | 249.51,55.31 OPTO25.3 | 249.07,55.75 249.51,55.31 | 256.01,56.03 v255.91,56.03 256.14,56.03 | 256.14,56.03 256.59,56.03 | 256.59,56.03 257.15,56.03 | 257.15,56.03 262.51,56.03 263.75,54.79 OPTO27.3 263.75,50.93 266.29,48.39 OPTO29.3 266.35,47.94 266.35,45.36 264.99,44 | 108.44,43.94 104.52,43.94 103.3,45.16 OPTO1.3 103.3,48.51 | 108.44,43.94 109.96,43.94 110.3,44.28 | 110.3,44.28 OPTO2.3 | 108.44,43.94 108.41,43.91 110.67,43.91 | 110.67,43.91 115.9,43.91 | 115.9,43.91 117.02,43.91 117.4,44.29 | 115.9,43.91 115.85,43.86 117.76,43.86 | 117.4,44.29 117.4,47.99 OPTO3.3 | 117.76,43.86 122.66,43.86 122.68,43.88 124.11,43.88 | 124.56,44.34 124.11,43.88 | 124.56,44.34 124.56,48.04 OPTO30.3 | 124.11,43.88 125.02,43.88 | 125.02,43.88 129.62,43.88 | 129.62,43.88 131.14,43.88 131.55,44.29 | 131.55,44.29 OPTO31.3 | 129.62,43.88 129.59,43.86 131.83,43.86 | 131.83,43.86 136.83,43.86 136.85,43.88 138.17,43.88 | 138.56,44.27 OPTO32.3 | 138.56,44.27 138.17,43.88 | 138.17,43.88 138.89,43.88 | 138.89,43.88 142.45,43.88 | 142.85,43.88 142.45,43.88 | 142.85,43.88 143.25,43.88 | 143.29,43.88 143.91,43.88 | 152.33,43.81 152.78,44.27 | 152.78,44.27 152.78,48.08 OPTO34.3 | 152.33,43.81 153.16,43.81 | 153.16,43.81 159.51,43.81 | 159.51,43.81 159.9,44.19 | 159.9,44.19 159.9,48.05 OPTO35.3 | 159.51,43.81 160.23,43.81 | 160.23,43.81 164.9,43.81 | 164.9,43.81 166.58,43.81 166.96,44.19 | 164.9,43.81 164.87,43.78 167.36,43.78 | 166.96,44.19 166.96,48.01 OPTO36.3 | 167.36,43.78 172.54,43.78 173.95,45.19 173.95,45.23 | 173.95,45.23 173.95,45.62 | 173.95,45.62 OPTO37.3 | 187.96,43.04 188.37,43.45
  Top 0.406: 188.37,43.45 OPTO39.3 | 187.96,43.04 185.62,43.04 184.69,42.11 180.36,42.11 179.33,43.15 179.33,44.88 | 187.96,43.04 188.72,43.04 | 188.72,43.04 194.69,43.04 | 195.22,43.57 OPTO40.3 | 194.69,43.04 195.22,43.57 | 194.69,43.04 195.58,43.04 | 195.58,43.04 201.93,43.04 | 201.93,43.04 202.36,43.48 | 202.36,43.48 202.36,47.99 OPTO41.3 | 201.93,43.04 202.8,43.04 | 202.8,43.04 v205.2,43.04 205.89,43.73 206.96,43.73 | 206.96,43.73 207.52,43.73 | 209.47,47.31 OPTO42.3 209.47,47.74 207.52,45.79 207.52,44.21 | 207.52,43.73 207.47,43.68 207.85,43.68 | 207.85,43.68 216.03,43.68 | 216.51,44.16 OPTO43.3 | 216.51,44.16 216.03,43.68 | 228.77,43.8 224.23,43.8 | 228.77,43.8 230.4,43.8 230.74,44.14 | OPTO45.3 230.74,44.14 | 228.77,43.8 228.65,43.68 231.14,43.68 | 231.14,43.68 235.97,43.68 235.99,43.71 237.37,43.71 | 237.37,43.71 237.76,44.1 | 237.76,44.1 237.9,44.24 | 237.9,44.24 237.9,47.86 OPTO46.3 | 237.37,43.71 237.95,43.71 | 238.41,43.71 237.95,43.71 | 238.41,43.71 243.77,43.71 243.79,43.68 244.5,43.68 | 244.5,43.68 244.96,44.14 | 244.96,44.14 244.96,47.92 OPTO47.3 | 244.5,43.68 245.42,43.68 | 245.42,43.68 251.11,43.68 | OPTO48.3 251.53,47.54 251.53,44.11 | 251.11,43.68 251.53,44.11 | 251.11,43.68 251.96,43.68 | 251.96,43.68 257.18,43.68 | 257.18,43.68 258.75,43.68 259.23,44.16 | 257.18,43.68 257.13,43.63 259.69,43.63 | 259.23,44.16 259.23,48 OPTO28.3 | 259.69,43.63 264.62,43.63 | 264.62,43.63 264.99,44 | OPTO13.3 163.72,52.58 161.6,54.7 | 161.6,54.7 161.26,55.05 | 161.26,55.05 161.24,55.06 157.76,55.06 | v162.29,56.08 161.6,55.39 | 161.6,55.39 161.26,55.05 | v218.6,43.79 218.5,43.68 216.92,43.68 | 216.92,43.68 216.03,43.68 | 129,54.96 129.1,55.06
  Top 0.406: v131.68,55.7 129.74,55.7 129.1,55.06 | v134.01,56.46 134.64,56.46 135.67,55.43 | 135.67,55.43 136.04,55.06 | OPTO20.3 214.01,53.82 213.99,53.84 213.99,55.31 | 213.99,55.31 213.99,55.7 | v82.6,25.01 82.6,24.94 80.69,23.02 U49.2 | 101.09,55.06 100.38,55.06 | 100.38,55.06 98.61,55.06 v98.58,55.09 | v266.14,42.62 265.63,42.62 264.99,43.26 | 264.99,43.26 264.62,43.63 | 143.45,55.43 144.48,56.46 148.9,56.46 150.2,55.16 | 143.45,55.43 143.08,55.06 | OPTO38.3 181.05,46.96 179.33,45.23 | 179.33,45.23 178.97,45.23 | 178.97,45.23 174.35,45.23 | 174.35,45.23 173.95,45.23 | 179.33,44.88 179.33,45.23 | 220.07,55.7 214.38,55.7 | 214.38,55.7 213.99,55.7 | 197,56.31 196.65,56.31 | OPTO18.3 197.51,52.6 196.65,53.45 196.65,55.95 | 196.65,55.96 196.65,56.31 | TTL-RS1.GND 241.2,16.23 242.98,18 242.98,27.63 240.97,29.64 231.29,29.64 229.41,31.52 SV1.10 | OPTO6.3 100.72,54.68 | 157.76,55.06 157.28,54.58 | OPTO12.3 157.28,54.58 | v253.93,17.72 254.54,18.33 254.54,30.78 258.17,34.42 JP2.2 | v89.16,31.97 91.62,31.97 v92.61,32.96 | 152.33,43.81 143.91,43.81 | 145.63,47.27 OPTO33.3 142.85,45.34 142.85,44.32 | 206.52,56.81 206.92,56.4 | OPTO19.3 206.92,55.48 | 206.92,55.48 206.92,55.8 | 206.92,55.8 206.92,56.11 | 206.92,56.11 206.92,56.4 | 207.42,56.81 212.88,56.81 213.99,55.7 | 207.42,56.81 206.52,56.81 | 206.52,56.81 197.5,56.81 197,56.31 | 107.79,54.73 108.12,55.06 | 107.79,54.73 107.67,54.73 107.34,55.06 | 100.72,54.68 100.72,54.73 100.38,55.06 | 114.89,54.68 114.51,55.06 | 114.89,54.68 115.27,55.06 | 121.97,54.73 121.64,55.06 | 121.97,54.73 122.3,55.06 | 129,54.63 128.63,55.01 128.63,55.06 | 128.91,55.06 129.1,55.06 | 136.04,55.06 136.04,55.07 136.4,55.43
  Top 0.406: 143.08,55.06 142.75,55.39 142.75,55.43 | 150.2,54.68 150.57,55.06 | 150.2,54.68 150.2,55.16 | 150.2,55.16 150.29,55.06 150.57,55.06 | 157.28,54.58 157.25,54.58 156.77,55.06 | 161.6,55.39 161.6,54.7 | 174.35,45.23 173.95,45.62 | 178.97,45.23 179.33,44.88 | 188.37,43.45 188.37,43.4 188.72,43.04 | 195.58,43.04 195.22,43.4 195.22,43.57 | 202.8,43.04 202.36,43.47 202.36,43.48 | 216.92,43.68 216.51,44.09 216.51,44.16 | 207.52,44.21 207.52,44.01 | 207.52,44.01 207.52,43.73 | 207.85,43.68 207.52,44.01 | 206.96,43.73 207.44,44.21 207.52,44.21 | 110.67,43.91 110.3,44.28 | 117.76,43.86 117.4,44.21 117.4,44.29 | 125.02,43.88 124.56,44.34 | 131.83,43.86 131.55,44.14 131.55,44.29 | 138.89,43.88 138.56,44.21 138.56,44.27 | 142.85,44.29 142.85,43.88 | v142.82,42.62 142.82,43.45 | 142.82,43.45 142.82,43.85 142.85,43.88 | 142.45,43.88 142.85,44.29 | 142.85,44.29 142.85,44.32 | 142.85,44.32 143.29,43.88 | 142.45,43.88 142.45,43.83 142.82,43.45 | 142.82,43.45 143.25,43.88 | 143.25,43.88 143.29,43.88 | 153.16,43.81 152.78,44.19 152.78,44.27 | 160.23,43.81 159.9,44.14 159.9,44.19 | 167.36,43.78 166.96,44.19 | 171.47,55.57 171.91,56.01 171.91,56.03 | 178.56,55.55 178.56,55.61 178.97,56.03 | 186.08,55.06 185.68,54.66 | 192.76,55.56 193.5,56.31 196.3,56.31 | 192.76,55.56 192.26,55.06 | 196.65,56.31 196.3,56.31 | OPTO17.3 192.76,54.63 | 192.76,54.63 192.76,55.56 | 192.26,55.06 192.69,54.63 192.76,54.63 | 196.65,55.95 196.3,56.31 | 197,56.31 196.65,55.96 | 196.65,55.96 196.65,55.95 | v206,55.79 206.01,55.8 206.61,55.8 | 206.61,55.8 206.92,55.8 | 206.92,56.4 207.01,56.4 207.42,56.81 | 206.61,55.8 206.92,55.48 | 206.92,56.11 206.61,55.8 | 213.99,55.31 214.38,55.7
  Top 0.406: 221.08,55.24 221.54,55.7 | 228.2,55.23 228.2,55.29 228.65,55.75 | 235.28,55.22 235.28,55.31 235.71,55.75 | 242.39,55.24 242.39,55.31 242.83,55.75 | 249.07,55.75 249.84,55.75 | 249.84,55.75 251.56,55.75 v251.79,55.98 | 249.51,55.31 249.84,55.64 249.84,55.75 | 264.99,43.26 264.99,44 | 257.15,56.03 256.63,55.51 | OPTO26.3 256.63,55.51 | 256.59,55.54 256.14,56 256.14,56.03 | 256.63,55.51 256.59,55.54 | 256.59,55.54 256.59,56.03 | 259.23,44.16 259.23,44.09 259.69,43.63 | 251.53,44.11 251.96,43.68 | 244.96,44.14 245.42,43.68 | 237.9,44.24 238.41,43.73 238.41,43.71 | 237.95,43.71 237.76,43.9 237.76,44.1 | 230.74,44.14 230.74,44.08 231.14,43.68 | 224.23,43.8 223.67,44.37 | 223.67,44.37 OPTO44.3 | v222.64,43.8 223.22,43.8 | 223.22,43.8 224.23,43.8 | 223.22,43.8 223.67,44.25 223.67,44.37
  Bottom 0.2: R106.1 139.67,36.48 140.22,37.03 140.2,37.04 140.2,38.93 140.67,39.4 141.73,39.4 142.82,40.5 v142.82,42.62 | R114.1 196.11,37.55 195.81,37.85 195.81,40.4 196.94,41.54 203.53,41.54 205.03,43.04 v205.2,43.04 | R110.1 166.43,36.91 165.99,36.47 161.24,36.47 160.91,36.8 v160.91,36.87 | v152.21,50.02 152.43,49.8 152.43,37.76 v152.38,37.71 | IC4.10 140.92,54.91 141.42,55.41 v141.42,55.34 | v166.4,56.79 166.4,53.1 166.77,52.73 172.89,52.73 173.19,53.02 IC1.10 | IC5.10 205.19,54.95 205.6,55.36 205.6,55.37 206,55.77 v206,55.79
  Bottom 0.406: v162.29,56.08 162.97,56.76 166.37,56.76 v166.4,56.79 | v134.01,56.46 133.25,55.7 v131.68,55.7 | v82.6,25.01 87.23,25.01 87.89,25.67 87.89,28.21 | Q1.2 87.2,28.9 87.89,28.21 | v98.58,55.09 94.52,55.09 91.74,52.31 91.74,34.75 92.61,33.88 v92.61,32.96 | R110.1 R109.1 | R104.1 R105.1 | R105.1 | R106.1 138.68,36.5 R105.1 | v266.14,42.62 266.39,42.38 JP2.8 | TTL-RS1.GND 228.9,14.19 250.4,14.19 v253.93,17.72 | v251.79,55.98 251.95,56.13 255.93,56.13 255.93,56.05 v255.91,56.03 | R114.1 R112.1 | 87.89,28.21 87.89,30.83 89.03,31.97 v89.16,31.97 | v218.6,43.79 222.62,43.79 v222.64,43.8
  Bottom 1.016: JP2.2 JP2.4 JP2.6 JP2.8
N$1
  Bottom 0.2: D2.A 80.79,41 81.84,39.95 89.23,39.95 90.34,41.06 R1.2
N$2  (via drill 0.6)
  Top 0.2: LED1.+ 90.58,45.38 v90.38,45.59
  Bottom 0.2: v90.38,45.59 87.74,42.95 D2.C
N$3
  Bottom 0.2: D3.A 80.92,49.1 81.59,48.43 88.34,48.43 R2.2
N$4  (via drill 0.6)
  Top 0.2: LED2.+ 90.17,52.55 v90.15,52.57
  Bottom 0.2: v90.15,52.57 87.88,50.31 D3.C
N$5
  Bottom 0.2: D4.A 80.83,56.32 81.54,55.62 88.49,55.62 R3.2
N$6  (via drill 0.6)
  Top 0.2: LED3.+ 90.49,59.49 90.4,59.58 v90.41,59.59
  Bottom 0.2: v90.41,59.59 88.2,57.38 D4.C
N$7
  Bottom 0.2: D5.A 80.79,63.5 81.66,62.63 88.5,62.63 R4.2
N$8  (via drill 0.6)
  Top 0.2: LED4.+ 90.26,66.32 90.12,66.47 v90.1,66.47
  Bottom 0.2: v90.1,66.47 87.83,64.19 D5.C
N$9
  Bottom 0.2: D6.A 80.82,70.13 81.56,69.39 88.46,69.39 R5.2
N$10  (via drill 0.6)
  Top 0.2: LED5.+ 90.81,73.5 v90.48,73.83
  Bottom 0.2: v90.48,73.83 87.93,71.28 D6.C
N$11
  Bottom 0.2: D7.A 80.81,77.55 81.69,76.68 88.54,76.68 R6.2
N$12  (via drill 0.6)
  Top 0.2: LED6.+ 90.29,80.78 v90.2,80.69
  Bottom 0.2: v90.2,80.69 88.04,78.53 D7.C
N$13
  Bottom 0.2: D8.A 102.79,78.72 101.75,77.69 101.75,72.87 103.53,71.09 104.87,71.09 R7.2
N$14  (via drill 0.6)
  Top 0.2: LED7.+ 106.81,70.87 v106.96,71.03
  Bottom 0.2: v106.96,71.03 106.96,73.23 105.73,74.45 D8.C
N$15
  Bottom 0.2: D9.A 110.86,78.72 110.14,78 110.14,72.87 R8.2
N$16  (via drill 0.6)
  Top 0.2: LED8.+ 114.1,70.91 v114.13,70.95
  Bottom 0.2: v114.13,70.95 114.13,71.6 111.99,73.74 D9.C
N$17
  Bottom 0.2: D15.A 153.02,78.44 152.25,77.67 152.25,73.05 R14.2
N$18  (via drill 0.6)
  Top 0.2: v90.34,47.35 90.38,47.31 91.47,48.4 LED1.- 93.02,48.48 94.21,48.48 95.02,47.67 95.02,41.65 97.13,39.55 OPTO1.1
  Bottom 0.2: v90.34,47.35 89.61,46.63 Z1.C
N$19  (via drill 0.6)
  Top 0.2: v151.42,71.04 152.24,70.22 LED13.- 155.1,65.47 159.67,65.47 160.28,64.87 160.28,63.14 160.68,62.73 166.12,62.73 166.96,61.89 166.96,61.14 OPTO13.1
  Bottom 0.2: Z13.C 151.42,73.68 v151.42,71.04
N$20
  Bottom 0.2: D10.A 117.98,78.72 117.17,77.92 117.17,73.01 R9.2
N$21  (via drill 0.6)
  Top 0.2: v158.41,71.09 159.21,70.29 LED14.- 159.21,68.27 160.78,66.69 160.78,63.67 161.2,63.26 166.77,63.26 167.86,62.16 170.31,62.16 170.8,62.65 172.88,62.65 172.89,62.66 173.74,62.66 174.01,62.38 OPTO14.1
  Bottom 0.2: Z14.C 158.41,73.73 v158.41,71.09
N$22  (via drill 0.6)
  Top 0.2: LED9.+ 121.16,68.5 121.16,71.05 v121.26,70.94
  Bottom 0.2: v121.26,70.94 121.26,71.83 118.94,74.15 D10.C
N$23  (via drill 0.6)
  Top 0.2: v165.49,71.08 166.15,70.42 LED15.- 168.13,66.36 180.21,66.36 181.71,64.87 188.02,64.87 188.73,64.16 188.73,63.23 188.2,62.71 184.42,62.71 184.08,62.37 184.08,61.88 183.28,61.08 OPTO15.1
  Bottom 0.2: v165.49,71.08 164.62,71.94 Z15.C
N$24
  Bottom 0.2: D11.A 124.84,78.5 124.31,77.97 124.31,72.06 125.15,71.22 R10.2
N$25  (via drill 0.6)
  Top 0.2: v172.2,71.14 173.23,70.1 LED16.- 174.7,66.87 180.7,66.87 181.89,65.67 189.03,65.67 189.74,64.97 189.74,62.6 OPTO16.1
  Bottom 0.2: v172.2,71.14 171.62,71.71 Z16.C
N$26  (via drill 0.6)
  Top 0.2: LED10.+ 128.14,71.04 v128.18,71
  Bottom 0.2: v128.18,71 v128.17,71.01 128.17,73 126.93,74.23 D11.C
N$27  (via drill 0.6)
  Top 0.2: v179.29,71.13 180.1,70.32 LED17.- 180.1,68.27 182.11,66.26 193.02,66.26 195.3,63.98 OPTO17.1
  Bottom 0.2: Z17.C 179.29,73.67 v179.29,71.13
N$28
  Bottom 0.2: D12.A 131.76,78.69 131.12,78.05 131.12,72.41 | 131.12,72.41 131.12,72.34 | 131.12,72.41 132.33,71.19 R11.2
N$29  (via drill 0.6)
  Top 0.2: v186.12,71.12 186.66,70.58 LED18.- 188.09,66.87 195.08,66.87 199.04,62.91 201.07,62.91 202.38,61.59 OPTO18.1
  Bottom 0.2: v186.12,71.12 186.09,71.15 | 186.09,71.15 | 186.09,71.15 185.32,71.92 Z18.C
N$30  (via drill 0.6)
  Top 0.2: LED11.+ 135.04,70.08 135.57,70.62 v135.57,71.06
  Bottom 0.2: v135.57,71.06 135.57,71.88 133.03,74.42 D12.C
N$31  (via drill 0.6)
  Top 0.2: v192.98,71.14 193.58,70.55 LED19.- 194.97,68.25 197.25,65.97 205.24,65.97 206.49,64.72 206.49,63.18 206.94,62.73 208.59,62.73 209.46,61.86 OPTO19.1
  Bottom 0.2: v192.98,71.14 192.15,71.98 Z19.C
N$32  (via drill 0.6)
  Top 0.2: v199.91,71.43 200.53,70.81 LED20.- 202.13,66.58 207.53,66.58 209.26,64.85 220.94,64.85 222,63.8 222,63.11 221.59,62.71 220.47,62.71 218.86,61.09 OPTO20.1
  Bottom 0.2: v199.91,71.43 199.07,72.27 Z20.C
N$33  (via drill 0.6)
  Top 0.2: OPTO21.1 223.63,63 221,65.63 215.98,65.63 215.13,66.48 209.44,66.48 LED21.- 207.69,68.6 206.74,69.56 v206.74,71.41
  Bottom 0.2: v206.74,71.41 206.02,72.13 Z21.C
N$34  (via drill 0.6)
  Top 0.2: LED14.+ 156.19,70.43 v156.74,70.97
  Bottom 0.2: D15.C 154.21,74.17 156.74,71.63 v156.74,70.97
N$35  (via drill 0.6)
  Top 0.2: OPTO22.1 230.74,62.68 228.86,64.56 223.9,64.56 222.1,66.35 216.24,66.35 LED22.- 214.36,70.58 v213.56,71.38
  Bottom 0.2: v213.56,71.38 212.87,72.07 Z22.C
N$36
  Bottom 0.2: D13.A 138.93,78.65 138.25,77.97 138.25,72.1 139.18,71.17 R12.2
N$37  (via drill 0.6)
  Top 0.2: OPTO23.1 237.82,62.18 235.46,64.53 229.69,64.53 228.75,65.47 224.11,65.47 LED23.- 221.34,70.52 v220.74,71.13 v220.74,71.14
  Bottom 0.2: v220.74,71.14 219.61,72.26 Z23.C
N$38  (via drill 0.6)
  Top 0.2: LED12.+ 142.2,68.36 142.2,70.67 v142.6,71.07
  Bottom 0.2: v142.6,71.07 142.6,72.02 140.24,74.38 D13.C
N$39  (via drill 0.6)
  Top 0.2: OPTO24.1 244.93,62.18 242.62,64.48 236.45,64.48 235.54,65.4 230.72,65.4 LED24.- 227.88,70.7 227.48,71.1 v227.48,71.14
  Bottom 0.2: v227.48,71.14 226.26,72.36 Z24.C
N$40
  Bottom 0.2: D14.A 146.33,78.46 145.34,77.46 145.34,72.9 R13.2
N$41  (via drill 0.6)